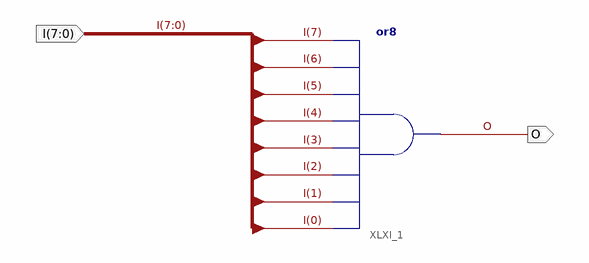
[diagram p0: schematic sheet 1]
// Xilinx ISE schematic Or8Bus.sch (xc9500xl) as structural Verilog: 1 symbols, 2 ports
module Or8Bus (
  input  [7:0] I,
  output O
);

  or XLXI_1 (O, I[0], I[1], I[2], I[3], I[4], I[5], I[6], I[7]);
endmodule
